# EAGLE design bits (EAGLE 9.3.0)
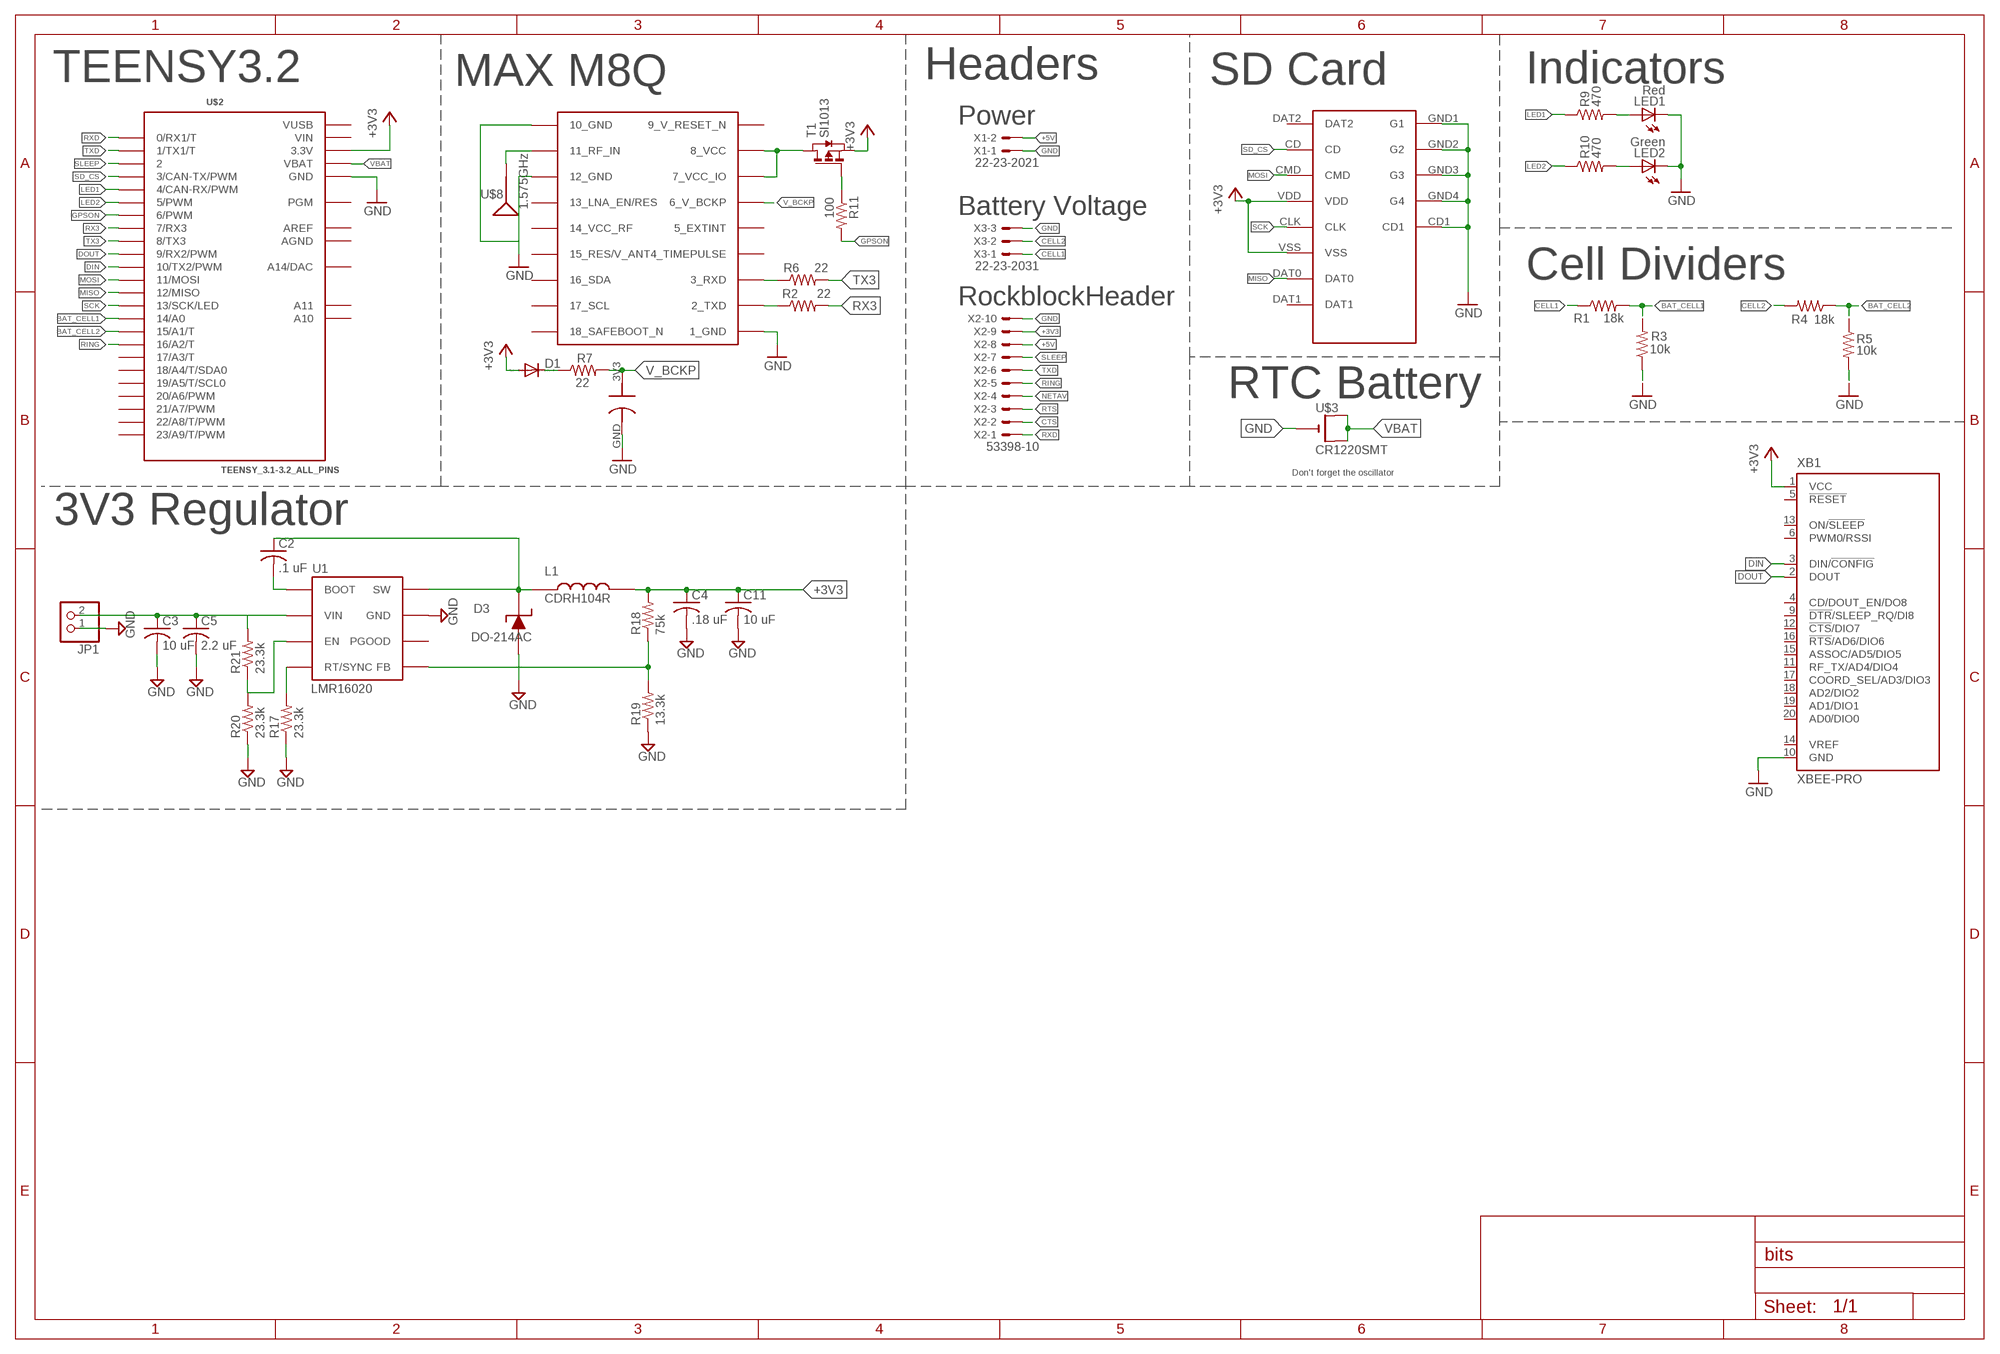
[diagram p0: schematic, sheet 1]

## Parts
C1  DCK-3R3E204T614-E  [ELNASUPERCAP]
C2  .1 uF  C-USC0603  [C0603]
C3  10 uF  C-USC1210  [C1210]
C4  .18 uF  C-USC0603  [C0603]
C5  2.2 uF  C-USC1210  [C1210]
C11  10 uF  C-USC0603  [C0603]
D1  DIODE-SOD523  [SOD523]
D3  DO-214AC  [DO-214AC]
JP1  PINHD-1X2  [1X02]
L1  CDRH104R  [CDRH104R]
LED1  Red  LEDCHIP-LED0603  [CHIP-LED0603]
LED2  Green  LEDCHIP-LED0603  [CHIP-LED0603]
R1  18k  R-US_R0603  [R0603]
R2  22  R-US_R0603  [R0603]
R3  10k  R-US_R0603  [R0603]
R4  18k  R-US_R0603  [R0603]
R5  10k  R-US_R0603  [R0603]
R6  22  R-US_R0603  [R0603]
R7  22  R-US_R0603  [R0603]
R9  470  R-US_R0603  [R0603]
R10  470  R-US_R0603  [R0603]
R11  100  R-US_R0603  [R0603]
R17  23.3k  R-US_R0603  [R0603]
R18  75k  R-US_R0603  [R0603]
R19  13.3k  R-US_R0603  [R0603]
R20  23.3k  R-US_R0603  [R0603]
R21  23.3k  R-US_R0603  [R0603]
T1  SI1013  [SC-75]
U1  LMR16020  [SO8]
U$2  TEENSY_3.1-3.2_ALL_PINS  [TEENSY_3.0-3.2&LC_ALL_PINS]
U$3  CR1220SMT  [CR1220-SMD]
U$4  MICRO_SD  [MICRO_SD_HINGED]
U$7  MAX-M8  [MAX-M8]
U$8  1.575GHz  SPARKFUN-GPS_ANTENNAGPS-2X7MM  [SPARKFUN-GPS_ANT-GPS-2X7MM]
X1  22-23-2021  [22-23-2021]
X2  53398-10  [53398-10]
X3  22-23-2031  [22-23-2031]
XB1  XBEE-PRO  [XBEE-PRO]

## Nets
+3V3: C4.1 C11.1 D1.A L1.P$2 R18.2 T1.P$2(S) U$2.3.3V U$2.3.3V1(3.3V) U$4.VDD U$4.VSS X2.9 XB1.1(VCC)
+5V: X1.2 X2.8
BAT_CELL1: R1.2 R3.2 U$2.14/A0
BAT_CELL2: R4.1 R5.1 U$2.15/A1(15/A1/T)
CELL1: R1.1 X3.1
CELL2: R4.2 X3.2
CTS: X2.2
DIN: U$2.10(10/TX2/PWM) XB1.3(DIN/!CONFIG)
DOUT: U$2.9(9/RX2/PWM) XB1.2(DOUT)
GND: C1.GND C3.2 C4.2 C5.2 C11.2 D3.P$1 JP1.1 LED1.C LED2.C R3.1 R5.2 R17.1 R19.1 R20.1 U1.P$7(GND) U1.PAD(GND) U$2.GND U$2.GND1(GND) U$3.- U$4.CD1 U$4.GND1(G1) U$4.GND2(G2) U$4.GND3(G3) U$4.GND4(G4) U$7.1_GND U$7.10_GND U$7.12_GND X1.1 X2.10 X3.3 XB1.10(GND)
GPSON: R11.2 U$2.6(6/PWM)
IN1: C3.1 C5.1 JP1.2 R21.2 U1.P$2(VIN)
LED1: R9.1 U$2.4(4/CAN-RX/PWM)
LED2: R10.1 U$2.5(5/PWM)
MISO: U$2.12(12/MISO) U$4.DAT0
MOSI: U$2.11(11/MOSI) U$4.CMD
N$1: U$7.11_RF_IN U$8.1(SIGNAL)
N$2: D1.C R7.1
N$3: R6.1 U$7.3_RXD
N$4: R2.1 U$7.2_TXD
N$5: LED2.A R10.2
N$6: LED1.A R9.2
N$9: R11.1 T1.P$1(G)
N$11: T1.P$3(D) U$7.7_VCC_IO U$7.8_VCC
N$29: R17.2 U1.P$4(RT/SYNC)
N$31: C2.2 U1.P$1(BOOT)
N$32: C2.1 D3.P$2 L1.P$1 U1.P$8(SW)
N$33: R18.1 R19.2 U1.P$5(FB)
N$34: R20.2 R21.1 U1.P$3(EN)
NETAV: X2.4
RING: U$2.16/A2(16/A2/T) X2.5
RTS: X2.3
RX3: R2.2 U$2.7(7/RX3)
RXD: U$2.0(0/RX1/T) X2.1
SCK: U$2.13(13/SCK/LED) U$4.CLK
SD_CS: U$2.3(3/CAN-TX/PWM) U$4.CD
SLEEP: U$2.2 X2.7
TX3: R6.2 U$2.8(8/TX3)
TXD: U$2.1(1/TX1/T) X2.6
V_BCKP: C1.3V3 R7.2 U$7.6_V_BCKP
VBAT: U$2.VBAT U$3.+$1(+) U$3.+$2(+1)
Unconnected: U1.P$6(PGOOD) U$2.17/A3(17/A3/T) U$2.18/A4(18/A4/T/SDA0) U$2.19/A5(19/A5/T/SCL0) U$2.20/A6(20/A6/PWM) U$2.21/A7(21/A7/PWM) U$2.22/A8(22/A8/T/PWM) U$2.23/A9(23/A9/T/PWM) U$2.A10 U$2.A11 U$2.PGM U$2.RESET/DAC(A14/DAC) U$4.DAT1 U$4.DAT2 U$7.4_TIMEPULSE U$7.5_EXTINT U$7.13_LNA_EN(13_LNA_EN/RES) U$7.14_VCC_RF U$7.15_V_ANT/RESERVED(15_RES/V_ANT) U$7.16_SDA U$7.17_SCL U$7.18_SAFEBOOT_N XB1.4(CD/DOUT_EN/DO8) XB1.5(!RESET) XB1.6(PWM0/RSSI) XB1.9(!DTR!/SLEEP_RQ/DI8) XB1.11(RF_TX/AD4/DIO4) XB1.12(!CTS!/DIO7) XB1.13(ON/!SLEEP) XB1.14(VREF) XB1.15(ASSOC/AD5/DIO5) XB1.16(!RTS!/AD6/DIO6) XB1.17(COORD_SEL/AD3/DIO3) XB1.18(AD2/DIO2) XB1.19(AD1/DIO1) XB1.20(AD0/DIO0)

## Notes on the sheet
- TEENSY3.2 | MAX M8Q | Headers | SD Card | Indicators
- Power
- Battery Voltage
- Cell Dividers
- RockblockHeader
- RTC Battery
- Don't forget the oscillator
- 3V3 Regulator

## Power pins joined to a net without a drawn wire
9_V_RESET_N: U$7.9_RESET_N(9_V_RESET_N)
AGND: U$2.AGND
AREF: U$2.AREF
VIN: U$2.VIN
VUSB: U$2.VUSB

## Library data of the parts
C1 = jmolterLib:DCK-3R3E204T614-E: ELNA Supercapacitor 3.3V max DCK-3R3E204T614-E 0.2F DCK-3R3E404T614-E 0.4F
C2-C5 C11 = resistor:C-US: CAPACITOR, American symbol
D1 = diode:DIODE-: DIODE
D3 = HASP:DO-214AC
JP1 = pinhead:PINHD-1X2: PIN HEADER
L1 = library:CDRH104R
LED1 LED2 = led:LED: LED OSRAM: - CHIPLED LG R971, LG N971, LY N971, LG Q971, LY Q971, LO R971, LY R971 LH N974, LH R974 LS Q976, LO Q976, LY Q976 LO Q996 - Hyper CHIPLED LW Q18S LB Q993, LB Q99A, LB R99A - SideLED LS A670, LO A670, LY A670, LG A670, LP A670 LB A673, LV A673, LT A673, LW A673 LH A674 LY A675 LS A676, LA A676, LO A676, LY A676, LW A676 LS A679, LY A679, LG A679 - Hyper Micro SIDELED® LS Y876, LA Y876, LO Y876, LY Y876 LT Y87S - SmartLED LW L88C, LW L88S LB L89C, LB L89S, LG L890 LS L89K, LO L89K, LY L89K LS L896, LA L896, LO L896, LY L896 - TOPLED LS T670, LO T670, LY T670, LG T670, LP T670 LSG T670, LSP T670, LSY T670, LOP T670, LYG T670 LG T671, LOG T671, LSG T671 LB T673, LV T673, LT T673, LW T673 LH T674 LS T676, LA T676, LO T676, LY T676, LB T676, LH T676, LSB T676, LW T676 LB T67C, LV T67C, LT T67C, LS T67K, LO T67K, LY T67K, LW E67C LS E67B, LA E67B, LO E67B, LY E67B, LB E67C, LV E67C, LT E67C LW T67C LS T679, LY T679, LG T679 LS T770, LO T770, LY T770, LG T770, LP T770 LB T773, LV T773, LT T773, LW T773 LH T774 LS E675, LA E675, LY E675, LS T675 LS T776, LA T776, LO T776, LY T776, LB T776 LHGB T686 LT T68C, LB T68C - Hyper Mini TOPLED® LB M676 - Mini TOPLED Santana® LG M470 LS M47K, LO M47K, LY M47K Source: http://www.osram.convergy.de LUXEON: - LUMILED® LXK2-PW12-R00, LXK2-PW12-S00, LXK2-PW14-U00, LXK2-PW14-V00 LXK2-PM12-R00, LXK2-PM12-S00, LXK2-PM14-U00 LXK2-PE12-Q00, LXK2-PE12-R00, LXK2-PE12-S00, LXK2-PE14-T00, LXK2-PE14-U00 LXK2-PB12-K00, LXK2-PB12-L00, LXK2-PB12-M00, LXK2-PB14-N00, LXK2-PB14-P00, LXK2-PB14-Q00 LXK2-PR12-L00, LXK2-PR12-M00, LXK2-PR14-Q00, LXK2-PR14-R00 LXK2-PD12-Q00, LXK2-PD12-R00, LXK2-PD12-S00 LXK2-PH12-R00, LXK2-PH12-S00 LXK2-PL12-P00, LXK2-PL12-Q00, LXK2-PL12-R00 Source: www.luxeon.com KINGBRIGHT: KA-3528ASYC Source: www.kingbright.com
R1 R3-R5 R9 R10 R17-R21 = resistor:R-US_: RESISTOR, American symbol
R2 R6 R7 R11 = rcl:R-US_: RESISTOR, American symbol; SPICEPREFIX: R
T1 = cmdLibs:SI1013: A PMOS that can be found in LTSPICE
U1 = HASP:LMR16020
U$2 = Teensy_3_and_LC_Series_Boards_v1.4:TEENSY_3.1-3.2_ALL_PINS: Footprint for Teensy 3.1 or 3.2 board using all through-holes, i.e. the entire perimeter plus the 4 through-holes inboard (A10,A11,AREF, VUSB)
U$3 = adafruit:CR1220: CR1216/CR1220/CR1225 12mm 3V lithium coin cell Great for battery packup. Both SMT and THM holders. Note the THM package has the ground pads on both sides of the PCB so that the masks are the same - this reduces the cost
U$4 = NR_connectors:MICRO_SD
U$7 = ubloxLib:MAX-M8: u-blox MAX GNSS module
U$8 = Tracksoar v2 :SPARKFUN-GPS_ANTENNA: Single-ended Antennae 1.575GHz antennae with just one terminal. These are all chip antennae. 1575MHz (GPS) Antennae ANT-GPS-2X7MM - 2.0 x 7.0 mm chip antenna. (SparkFun Product <https://www.sparkfun.com/products/9131>) ANT-GPS-2X8MM - 2.0 x 8.0 mm chip antenna. (SparkFun Product <https://www.sparkfun.com/products/8418>); PROD_ID: ANT-09087; SF_ID: GPS-09131
X1 = con-molex:22-23-2021: .100" (2.54mm) Center Header - 2 Pin; MF: MOLEX; MPN: 22-23-2021; OC_FARNELL: 1462926; OC_NEWARK: 25C3832
X2 = con-molex:53?-10: CONNECTOR wire to board 1.25 mm (.049 inch) pitch header; MF: MOLEX; MPN: 53398-1071; OC_FARNELL: unknown; OC_NEWARK: 59J0425
X3 = con-molex:22-23-2031: .100" (2.54mm) Center Header - 3 Pin; MF: MOLEX; MPN: 22-23-2031; OC_FARNELL: 1462950; OC_NEWARK: 30C0862
XB1 = maxstream:XBEE: XBee (TM) /XBee-PRO(TM) OEM RF Modules Source: MaxStream, Inc. xbee_productmanual.pdf; MPN: XBP24-AWI-001; OC_FARNELL: 1337916; OC_NEWARK: 42M2667

## Board
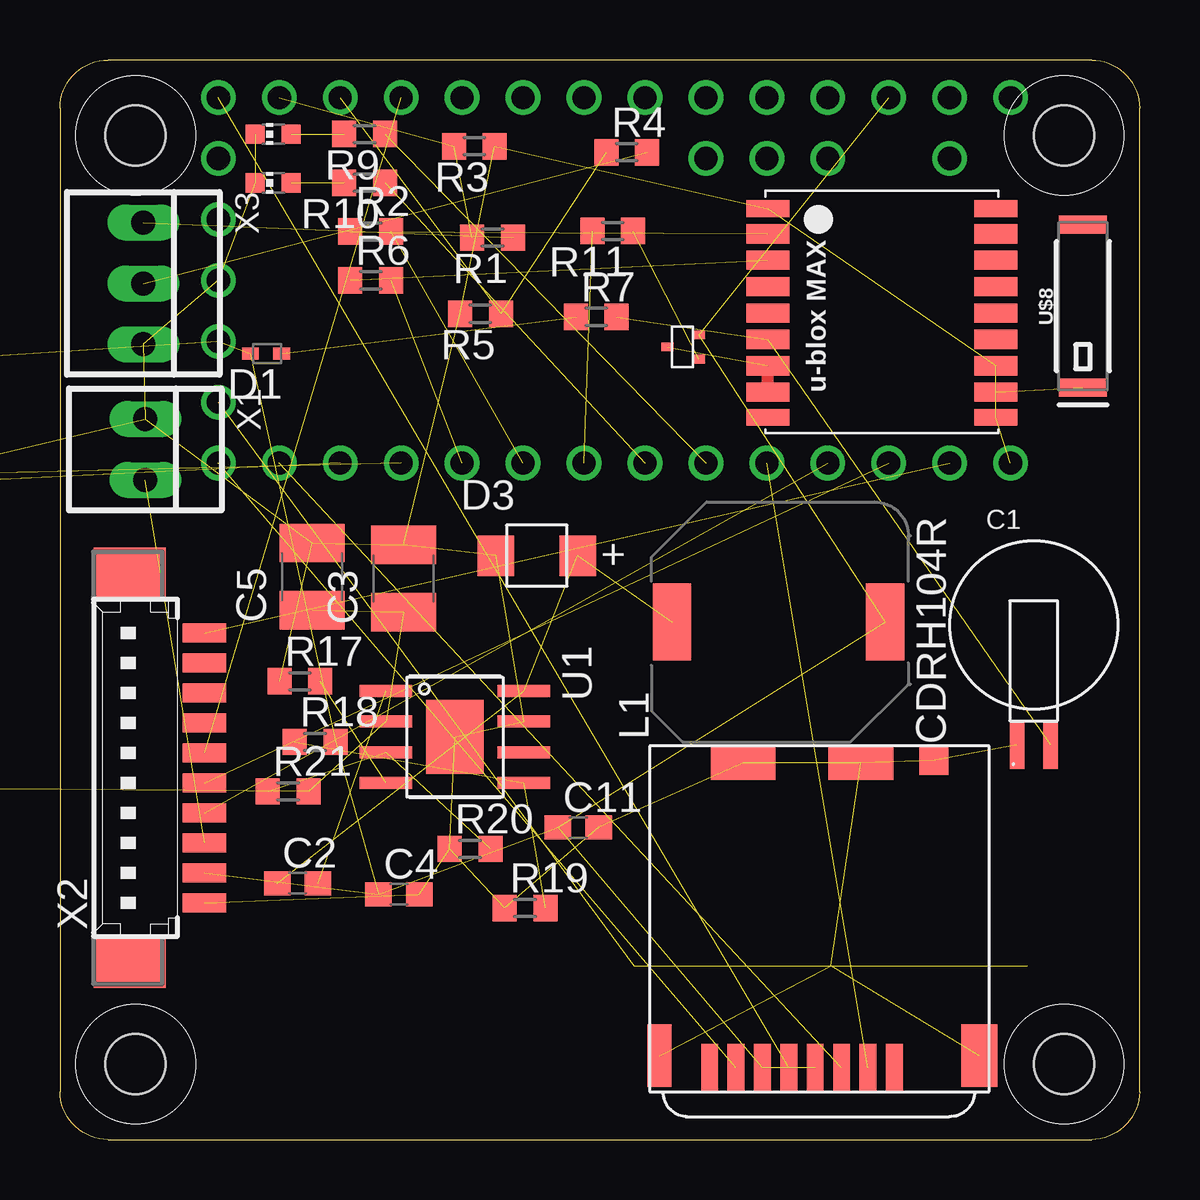
[diagram p1: board, top side]
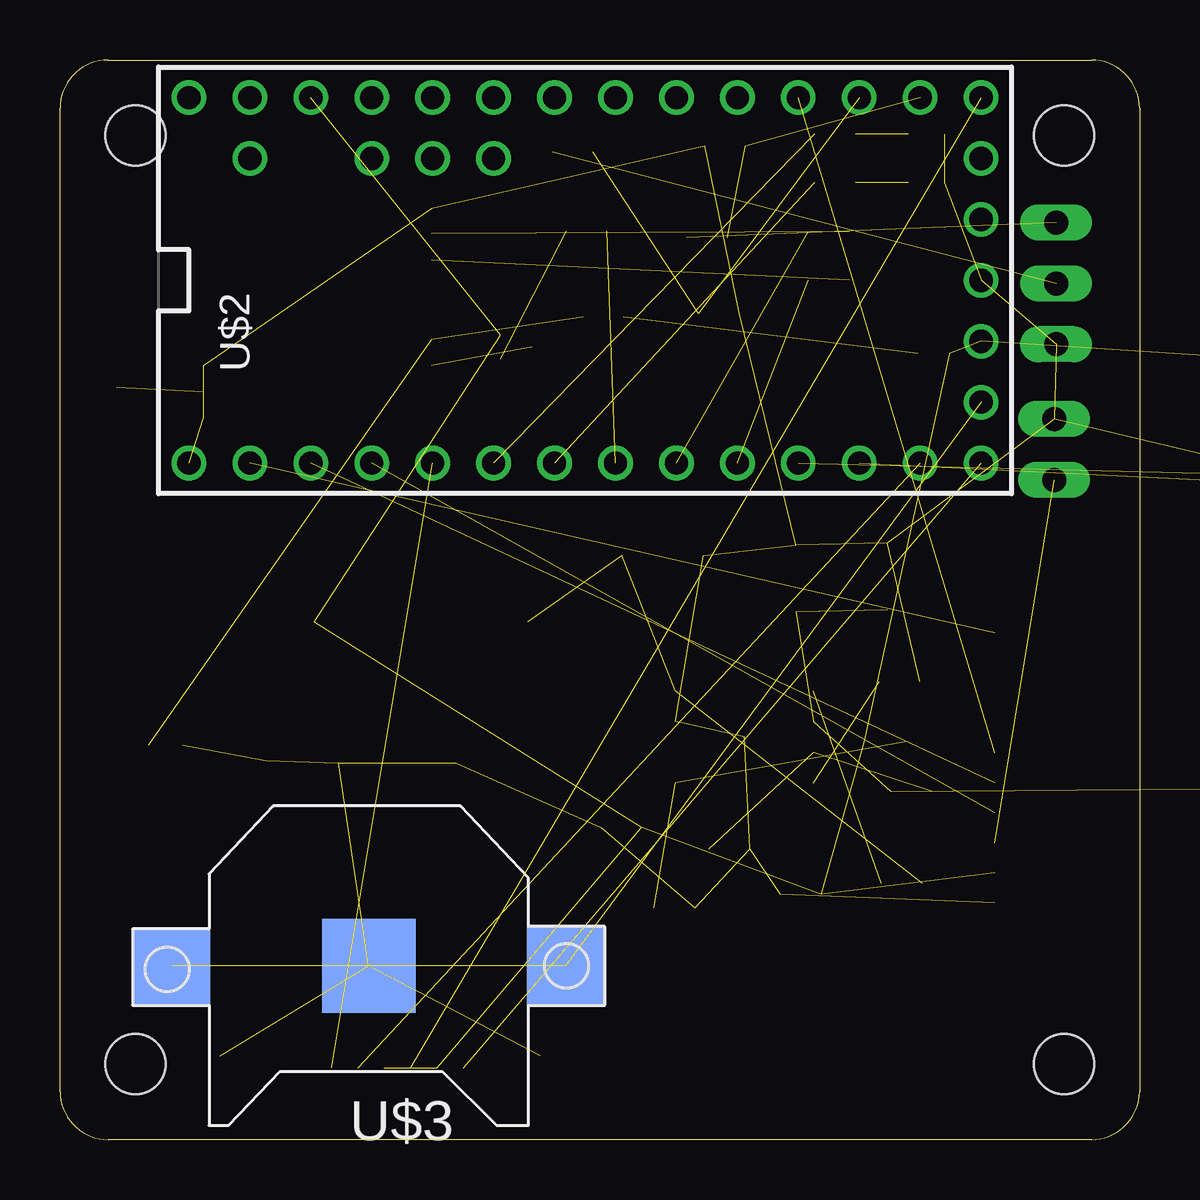
[diagram p2: board, bottom side, seen from below]

Size 45 x 45 mm. Coordinates in mm from the lower left corner, seen from the top.
Outline: 2,0 43,0 arc90 45,2 45,43 arc90 43,45 2,45 arc90 0,43 0,2 arc90 2,0
Copper layers (1*16): Top 0.035559375mm / dielectric 1.6mm / Bottom 0.035559375mm
Design rules "oshpark-2layer": minimum track width 6mil, minimum drill 10mil, track to track 6mil, track to pad 6mil, pad to pad 6mil, via to via 6mil, smd to smd 6mil, copper to edge 15mil, drill to drill 6mil, minimum pad ring 5mil, minimum via ring 5mil, stop-mask expansion 2.5mil, vias tented up to drill 0mil, thermal gap 10mil
Holes 2.5 mm at 3.15,3.15 3.15,41.85 41.85,3.15 41.85,41.85

### Footprints (pad centres in the part's own frame; a part is rotated, then mirrored left to right if it is on the bottom)
ELNASUPERCAP = smd 0.6 x 2: 3V3 0.7,-1.5; GND -0.7,-1.5
C0603 = smd 1.1 x 1: 1 -0.85,0; 2 0.85,0
C1210 = smd 1.6 x 2.7: 1 -1.4,0; 2 1.4,0
SOD523 = smd 0.7 x 0.5: A 0.7,0; C -0.6,0
DO-214AC = smd 1.524 x 1.676: P$1 -1.702,0; P$2 1.702,0
1X02 = drill 1.016 long: 1 -1.27,0; 2 1.27,0
CDRH104R = smd 3.2 x 1.598: P$1 0,4.445; P$2 0,-4.445
CHIP-LED0603 = smd 0.8 x 0.8: A 0,-0.75; C 0,0.75
R0603 = smd 1 x 1.1: 1 -0.85,0; 2 0.85,0
SC-75 = smd 0.356 x 0.503: P$1 0.178,0.251; P$2 1.18,0.251; P$3 0.686,1.55
SO8 = smd 0.5 x 2.2: P$1 -1.92,-2.875; P$2 -0.65,-2.875; P$3 0.65,-2.875; P$4 1.92,-2.875; P$5 1.92,2.875; P$6 0.65,2.875; P$7 -0.65,2.875; P$8 -1.92,2.875 | smd 3.1 x 2.4: PAD 0,0
TEENSY_3.0-3.2&LC_ALL_PINS = drill 0.965: 0 -7.62,13.97; 1 -7.62,11.43; 2 -7.62,8.89; 3 -7.62,6.35; 3.3V 7.62,11.43; 3.3V1 -2.54,-16.51; 4 -7.62,3.81; 5 -7.62,1.27; 6 -7.62,-1.27; 7 -7.62,-3.81; 8 -7.62,-6.35; 9 -7.62,-8.89; 10 -7.62,-11.43; 11 -7.62,-13.97; 12 -7.62,-16.51; 13 7.62,-16.51; 14/A0 7.62,-13.97; 15/A1 7.62,-11.43; 16/A2 7.62,-8.89; 17/A3 7.62,-6.35; 18/A4 7.62,-3.81; 19/A5 7.62,-1.27; 20/A6 7.62,1.27; 21/A7 7.62,3.81; 22/A8 7.62,6.35; 23/A9 7.62,8.89; A10 5.08,6.35; A11 5.08,3.81; AGND 7.62,13.97; AREF 5.08,8.89; GND -7.62,16.51; GND1 0,-16.51; PGM 2.54,-16.51; RESET/DAC 5.08,-16.51; VBAT -5.08,-16.51; VIN 7.62,16.51; VUSB 5.08,13.97
CR1220-SMD = smd 3.2 x 3.2: +$1 -8.2,0; +$2 8.2,0 | smd 3.9 x 3.9: - 0,0
MICRO_SD_HINGED = smd 0.7 x 2: CD -1.1,-13.4; CLK -4.4,-13.4; CMD -2.2,-13.4; DAT0 -6.6,-13.4; DAT1 -7.7,-13.4; DAT2 0,-13.4; VDD -3.3,-13.4; VSS -5.5,-13.4 | smd 2.7 x 1.4: CD1 -1.4,-0.7; GND3 -6.3,-0.7 | smd 1.5 x 2.6: GND1 3.55,-12.9 | smd 1.2 x 1.2: GND2 1.65,-0.6 | smd 1 x 2.6: GND4 -9.8,-12.9
MAX-M8 = smd 1.8 x 0.7: 1_GND 4.95,-4.4; 9_RESET_N 4.95,4.3; 10_GND -4.55,4.3; 18_SAFEBOOT_N -4.55,-4.4 | smd 1.8 x 0.8: 2_TXD 4.95,-3.35; 3_RXD 4.95,-2.25; 4_TIMEPULSE 4.95,-1.15; 5_EXTINT 4.95,-0.05; 6_V_BCKP 4.95,1.05; 7_VCC_IO 4.95,2.15; 8_VCC 4.95,3.25; 11_RF_IN -4.55,3.25; 12_GND -4.55,2.15; 13_LNA_EN -4.55,1.05; 14_VCC_RF -4.55,-0.05; 15_V_ANT/RESERVED -4.55,-1.15; 16_SDA -4.55,-2.25; 17_SCL -4.55,-3.35
SPARKFUN-GPS_ANT-GPS-2X7MM = smd 0.75 x 2: 1 -3.4,0; NC 3.4,0
22-23-2021 = drill 1 long: 1 -1.27,0; 2 1.27,0
53398-10 = smd 0.8 x 1.8: 1 5.625,-2.5; 2 4.375,-2.5; 3 3.125,-2.5; 4 1.875,-2.5; 5 0.625,-2.5; 6 -0.625,-2.5; 7 -1.875,-2.5; 8 -3.125,-2.5; 9 -4.375,-2.5; 10 -5.625,-2.5 | smd 2.1 x 3: S1 8.125,0.625; S2 -8.125,0.625
22-23-2031 = drill 1 long: 1 -2.54,0; 2 0,0; 3 2.54,0
XBEE-PRO = drill 0.8 pad 1.27: 1 -11,9; 2 -11,7; 3 -11,5; 4 -11,3; 5 -11,1; 6 -11,-1; 7 -11,-3; 8 -11,-5; 9 -11,-7; 10 -11,-9; 11 11,-9; 12 11,-7; 13 11,-5; 14 11,-3; 15 11,-1; 16 11,1; 17 11,3; 18 11,5; 19 11,7; 20 11,9

### Placement (x,y rotation side)
C1  40.59,17.95 0 top
C2  9.91,10.68 0 top
C3  14.32,23.38 90 top
C4  14.13,10.22 0 top
C5  10.51,23.46 90 top
C11  21.61,13 0 top
D1  8.64,32.77 180 top
D3  19.88,24.34 0 top
JP1  -49.01,16.26 270 top  (outside the outline)
L1  29.96,21.57 90 top
LED1  8.89,41.91 90 top
LED2  8.89,39.88 90 top
R1  18.03,37.59 180 top
R2  12.95,37.85 0 top
R3  17.27,41.4 180 top
R4  23.62,41.15 0 top
R5  17.53,34.42 180 top
R6  12.95,35.81 0 top
R7  22.35,34.29 0 top
R9  12.7,41.91 180 top
R10  12.7,39.88 180 top
R11  23.04,37.87 180 top
R17  10,19.1 0 top
R18  10.64,16.57 0 top
R19  19.38,9.65 0 top
R20  17.1,12.11 0 top
R21  9.51,14.51 0 top
T1  26.88,32.35 90 top
U1  16.46,16.78 270 top
U$2  23.11,35.81 90 bottom
U$3  32.13,7.24 180 bottom
U$4  34.78,16.4 0 top
U$7  34.46,34.4 180 top
U$8  42.64,34.73 90 top
X1  3.56,28.77 270 top
X2  3.52,15.49 90 top
X3  3.48,35.69 270 top
XB1  -64,19 0 top  (outside the outline)

### Tracks (layer width: path | path; a pad name or v marks a point on that pad's centre or on a via)
+3V3  (11 unrouted)
+5V  (1 unrouted)
BAT_CELL1  (2 unrouted)
BAT_CELL2  (2 unrouted)
CELL1  (1 unrouted)
CELL2  (1 unrouted)
DIN  (1 unrouted)
DOUT  (1 unrouted)
GND  (30 unrouted)
GPSON  (1 unrouted)
IN1  (4 unrouted)
LED1  (1 unrouted)
LED2  (1 unrouted)
MISO  (1 unrouted)
MOSI  (1 unrouted)
N$1  (1 unrouted)
N$2  (1 unrouted)
N$3  (1 unrouted)
N$4  (1 unrouted)
N$5  (1 unrouted)
N$6  (1 unrouted)
N$9  (1 unrouted)
N$11  (1 unrouted)
  Top 0.508: U$7.8_VCC U$7.7_VCC_IO
N$29  (1 unrouted)
N$31  (1 unrouted)
N$32  (3 unrouted)
N$33  (2 unrouted)
N$34  (2 unrouted)
RING  (1 unrouted)
RX3  (1 unrouted)
RXD  (1 unrouted)
SCK  (1 unrouted)
SD_CS  (1 unrouted)
SLEEP  (1 unrouted)
TX3  (1 unrouted)
TXD  (1 unrouted)
V_BCKP  (2 unrouted)
VBAT  (2 unrouted)